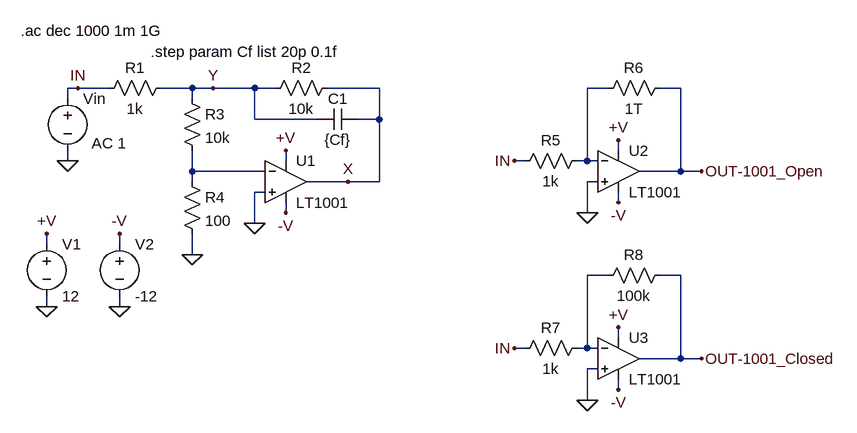
[diagram p0: schematic Fig_8-18_Loop-Gain_LT1001_AC-Definitions.asc]
Fig_8-18_Loop-Gain_LT1001_AC-Definitions.asc, the LTspice schematic file:
Version 4
SHEET 1 1752 700
WIRE 256 -1248 240 -1248
WIRE 304 -1248 256 -1248
WIRE 432 -1248 384 -1248
WIRE 464 -1248 432 -1248
WIRE 528 -1248 464 -1248
WIRE 560 -1248 528 -1248
WIRE 720 -1248 640 -1248
WIRE 1072 -1248 1040 -1248
WIRE 1184 -1248 1152 -1248
WIRE 240 -1232 240 -1248
WIRE 432 -1232 432 -1248
WIRE 528 -1200 528 -1248
WIRE 624 -1200 528 -1200
WIRE 720 -1200 720 -1248
WIRE 720 -1200 688 -1200
WIRE 1088 -1152 1088 -1168
WIRE 240 -1136 240 -1152
WIRE 576 -1136 576 -1152
WIRE 944 -1136 928 -1136
WIRE 1040 -1136 1040 -1248
WIRE 1040 -1136 1024 -1136
WIRE 1056 -1136 1040 -1136
WIRE 432 -1120 432 -1152
WIRE 544 -1120 432 -1120
WIRE 1184 -1120 1184 -1248
WIRE 1184 -1120 1120 -1120
WIRE 1216 -1120 1184 -1120
WIRE 432 -1104 432 -1120
WIRE 672 -1104 608 -1104
WIRE 720 -1104 720 -1200
WIRE 720 -1104 672 -1104
WIRE 1056 -1104 1040 -1104
WIRE 544 -1088 528 -1088
WIRE 1088 -1072 1088 -1088
WIRE 576 -1056 576 -1072
WIRE 1040 -1056 1040 -1104
WIRE 528 -1040 528 -1088
WIRE 208 -1008 208 -1024
WIRE 320 -1008 320 -1024
WIRE 432 -992 432 -1024
WIRE 1072 -960 1040 -960
WIRE 1184 -960 1152 -960
WIRE 208 -912 208 -928
WIRE 320 -912 320 -928
WIRE 1088 -864 1088 -880
WIRE 944 -848 928 -848
WIRE 1040 -848 1040 -960
WIRE 1040 -848 1024 -848
WIRE 1056 -848 1040 -848
WIRE 1184 -832 1184 -960
WIRE 1184 -832 1120 -832
WIRE 1216 -832 1184 -832
WIRE 1056 -816 1040 -816
WIRE 1088 -784 1088 -800
WIRE 1040 -768 1040 -816
FLAG 208 -1024 +V
FLAG 240 -1136 0
FLAG 672 -1104 X
FLAG 576 -1152 +V
FLAG 320 -1024 -V
FLAG 576 -1056 -V
FLAG 320 -912 0
FLAG 208 -912 0
FLAG 528 -1040 0
FLAG 432 -992 0
FLAG 464 -1248 Y
FLAG 1088 -1168 +V
FLAG 1088 -1072 -V
FLAG 1040 -1056 0
FLAG 256 -1248 IN
FLAG 928 -1136 IN
FLAG 1216 -1120 OUT-1001_Open
FLAG 1088 -880 +V
FLAG 1088 -784 -V
FLAG 1040 -768 0
FLAG 928 -848 IN
FLAG 1216 -832 OUT-1001_Closed
SYMBOL voltage 208 -1024 R0
WINDOW 123 0 0 Left 2
WINDOW 39 0 0 Left 2
SYMATTR InstName V1
SYMATTR Value 12
SYMBOL voltage 240 -1248 R0
WINDOW 123 37 85 Left 2
WINDOW 39 37 57 Left 2
SYMATTR Value2 AC 1
SYMATTR InstName Vin
SYMATTR Value ""
SYMBOL res 400 -1264 R90
WINDOW 0 0 56 VBottom 2
WINDOW 3 32 56 VTop 2
SYMATTR InstName R1
SYMATTR Value 1k
SYMBOL voltage 320 -1024 R0
WINDOW 123 24 146 Left 2
WINDOW 39 24 125 Left 2
SYMATTR InstName V2
SYMATTR Value -12
SYMBOL res 544 -1232 R270
WINDOW 0 32 56 VTop 2
WINDOW 3 0 56 VBottom 2
SYMATTR InstName R2
SYMATTR Value 10k
SYMBOL OpAmps\\LT1001 576 -1168 R0
SYMATTR InstName U1
SYMBOL cap 688 -1216 R90
WINDOW 0 0 32 VBottom 2
WINDOW 3 32 32 VTop 2
SYMATTR InstName C1
SYMATTR Value {Cf}
SYMBOL res 416 -1248 R0
SYMATTR InstName R3
SYMATTR Value 10k
SYMBOL res 416 -1120 R0
SYMATTR InstName R4
SYMATTR Value 100
SYMBOL OpAmps\\LT1001 1088 -1184 R0
SYMATTR InstName U2
SYMBOL res 1040 -1152 R90
WINDOW 0 0 56 VBottom 2
WINDOW 3 32 56 VTop 2
SYMATTR InstName R5
SYMATTR Value 1k
SYMBOL res 1168 -1264 R90
WINDOW 0 0 56 VBottom 2
WINDOW 3 32 56 VTop 2
SYMATTR InstName R6
SYMATTR Value 1T
SYMBOL OpAmps\\LT1001 1088 -896 R0
SYMATTR InstName U3
SYMBOL res 1040 -864 R90
WINDOW 0 0 56 VBottom 2
WINDOW 3 32 56 VTop 2
SYMATTR InstName R7
SYMATTR Value 1k
SYMBOL res 1168 -976 R90
WINDOW 0 0 56 VBottom 2
WINDOW 3 32 56 VTop 2
SYMATTR InstName R8
SYMATTR Value 100k
TEXT 168 -1336 Left 2 !.ac dec 1000 1m 1G
TEXT 368 -1304 Left 2 !.step param Cf list 20p 0.1f

The netlist it stands for:
* Fig_8-18_Loop-Gain_LT1001_AC-Definitions.asc
V1 +V 0 12
Vin IN 0 AC 1
R1 Y IN 1k
V2 -V 0 -12
R2 Y X 10k
XU1 0 N002 +V -V X LT1001  ; pins In+ In- V+ V- OUT
C1 X Y {Cf}
R3 Y N002 10k
R4 N002 0 100
XU2 0 N001 +V -V OUT-1001_Open LT1001  ; pins In+ In- V+ V- OUT
R5 N001 IN 1k
R6 OUT-1001_Open N001 1T
XU3 0 N003 +V -V OUT-1001_Closed LT1001  ; pins In+ In- V+ V- OUT
R7 N003 IN 1k
R8 OUT-1001_Closed N003 100k
.ac dec 1000 1m 1G
.step param Cf list 20p 0.1f
.lib LTC.lib
.backanno
.end